# EAGLE schematic Sine 5KW co sac (EAGLE 9.6.2)
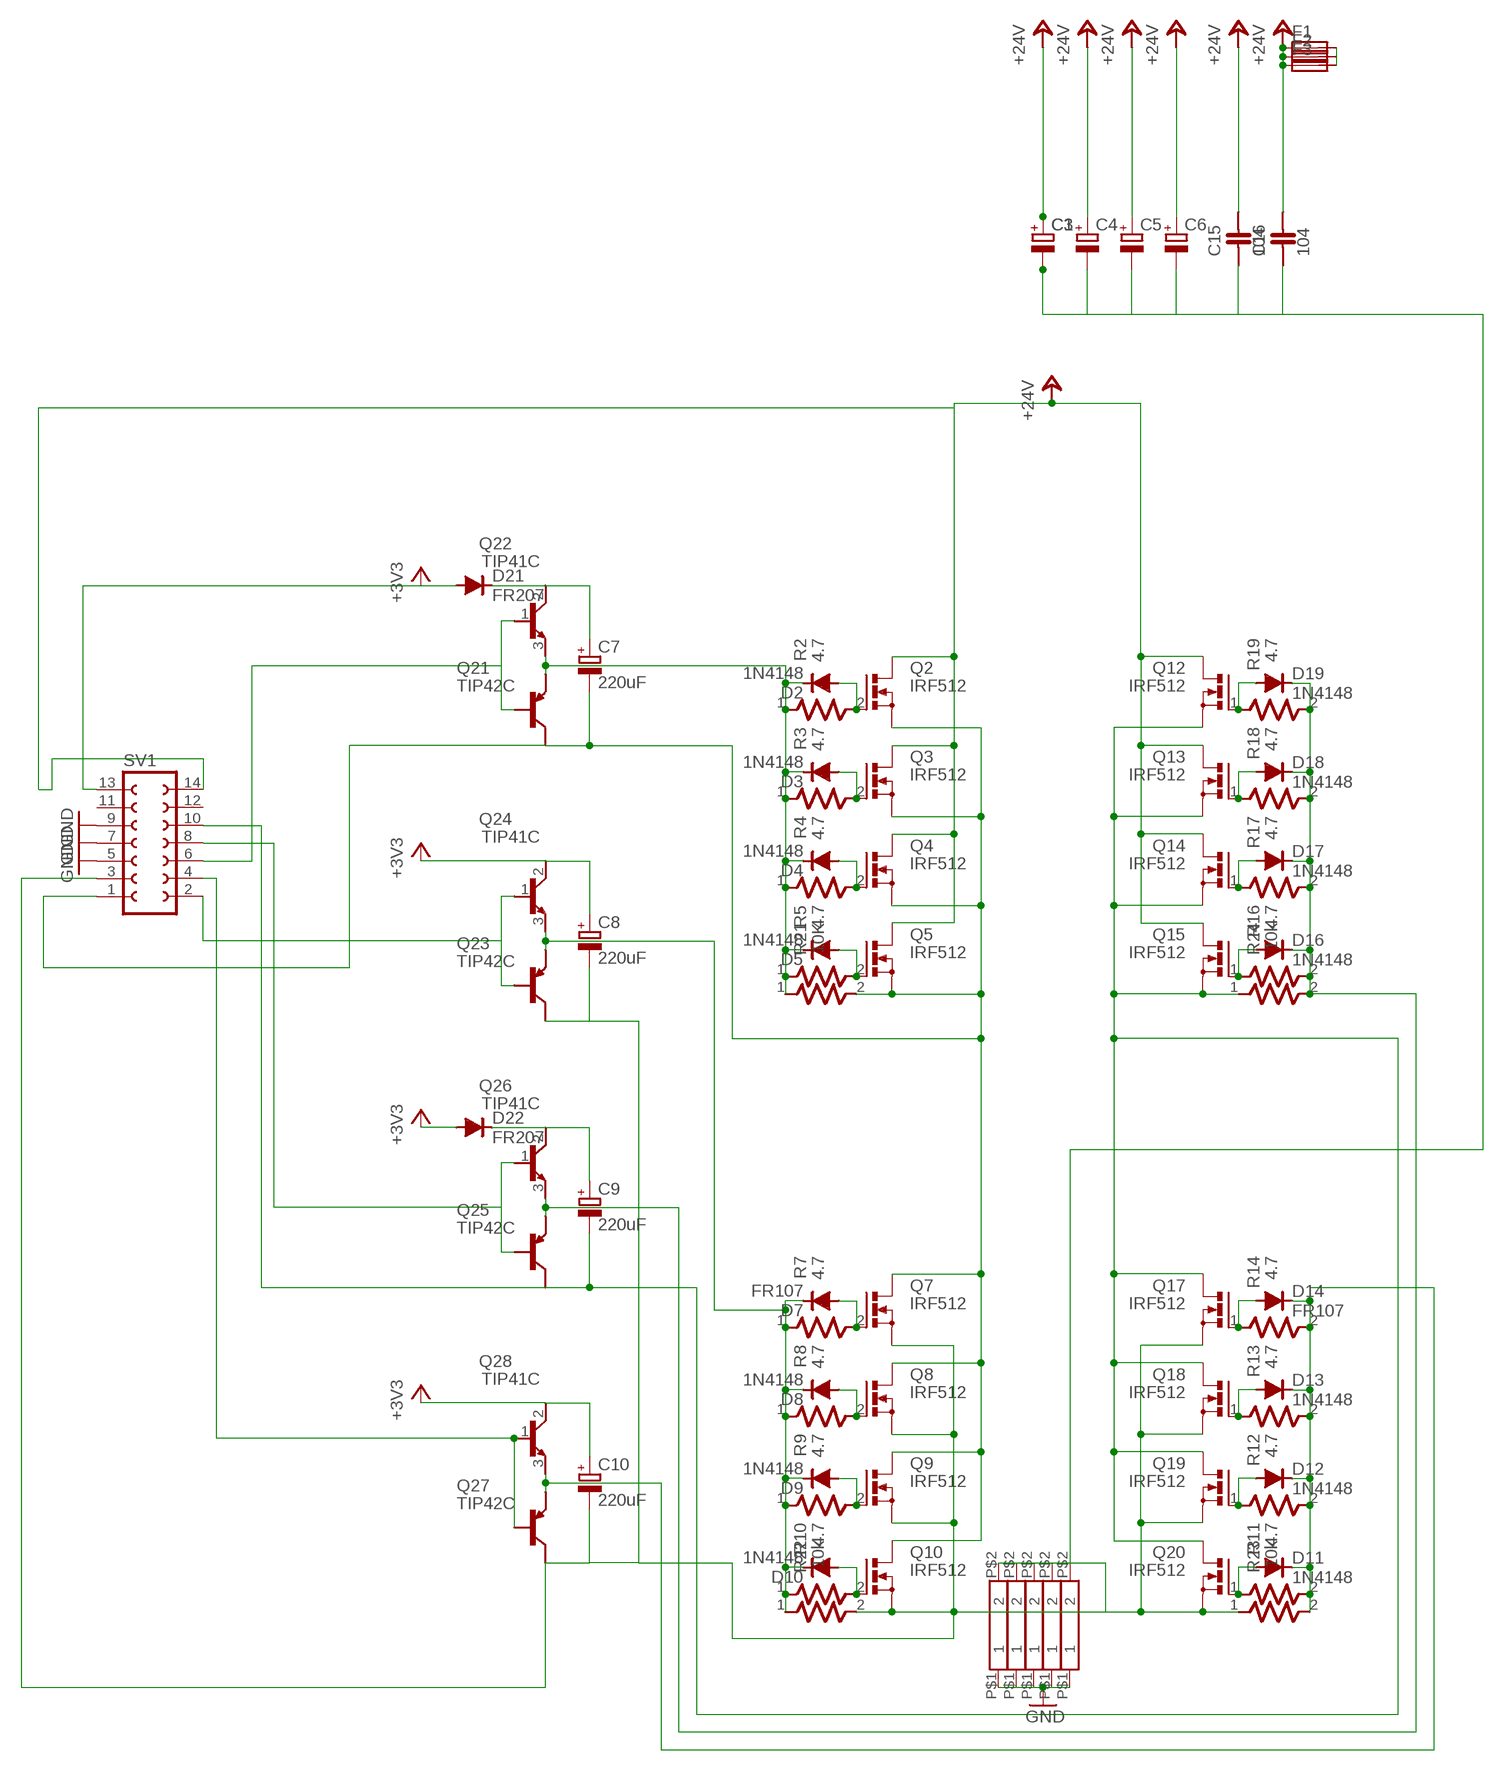
[diagram p0: schematic, sheet 1]

## Parts
C1  CPOL-EUE7.5-18  [E7,5-18]
C3  CPOL-EUE7.5-18  [E7,5-18]
C4  CPOL-EUE7.5-18  [E7,5-18]
C5  CPOL-EUE7.5-18  [E7,5-18]
C6  CPOL-EUE7.5-18  [E7,5-18]
C7  220uF  CPOL-EUE5-8.5  [E5-8,5]
C8  220uF  CPOL-EUE5-8.5  [E5-8,5]
C9  220uF  CPOL-EUE5-8.5  [E5-8,5]
C10  220uF  CPOL-EUE5-8.5  [E5-8,5]
C15  104  CAP-NP5  [CAP-NP5]
C16  104  CAP-NP5  [CAP-NP5]
D2  1N4148  [D-7,5]
D3  1N4148  [D-7,5]
D4  1N4148  [D-7,5]
D5  1N4148  [D-7,5]
D7  FR107  1N4148  [D-7,5]
D8  1N4148  [D-7,5]
D9  1N4148  [D-7,5]
D10  1N4148  [D-7,5]
D11  1N4148  [D-7,5]
D12  1N4148  [D-7,5]
D13  1N4148  [D-7,5]
D14  FR107  1N4148  [D-7,5]
D16  1N4148  [D-7,5]
D17  1N4148  [D-7,5]
D18  1N4148  [D-7,5]
D19  1N4148  [D-7,5]
D21  FR207  1N4148  [D-7,5]
D22  FR207  1N4148  [D-7,5]
F1  LITTLEFUSE  [LITTLEFUSE]
F2  LITTLEFUSE  [LITTLEFUSE]
F3  LITTLEFUSE  [LITTLEFUSE]
Q2  IRF512  [TO220BV]
Q3  IRF512  [TO220BV]
Q4  IRF512  [TO220BV]
Q5  IRF512  [TO220BV]
Q7  IRF512  [TO220BV]
Q8  IRF512  [TO220BV]
Q9  IRF512  [TO220BV]
Q10  IRF512  [TO220BV]
Q12  IRF512  [TO220BV]
Q13  IRF512  [TO220BV]
Q14  IRF512  [TO220BV]
Q15  IRF512  [TO220BV]
Q17  IRF512  [TO220BV]
Q18  IRF512  [TO220BV]
Q19  IRF512  [TO220BV]
Q20  IRF512  [TO220BV]
Q21  TIP42C  TIP-127  [TIP-127]
Q22  TIP41C  TIP122  [TIP-127]
Q23  TIP42C  TIP-127  [TIP-127]
Q24  TIP41C  TIP122  [TIP-127]
Q25  TIP42C  TIP-127  [TIP-127]
Q26  TIP41C  TIP122  [TIP-127]
Q27  TIP42C  TIP-127  [TIP-127]
Q28  TIP41C  TIP122  [TIP-127]
R2  4.7  R-7,5  [R-7,5]
R3  4.7  R-7,5  [R-7,5]
R4  4.7  R-7,5  [R-7,5]
R5  4.7  R-7,5  [R-7,5]
R7  4.7  R-7,5  [R-7,5]
R8  4.7  R-7,5  [R-7,5]
R9  4.7  R-7,5  [R-7,5]
R10  4.7  R-7,5  [R-7,5]
R11  4.7  R-7,5  [R-7,5]
R12  4.7  R-7,5  [R-7,5]
R13  4.7  R-7,5  [R-7,5]
R14  4.7  R-7,5  [R-7,5]
R16  4.7  R-7,5  [R-7,5]
R17  4.7  R-7,5  [R-7,5]
R18  4.7  R-7,5  [R-7,5]
R19  4.7  R-7,5  [R-7,5]
R21  10K  R-7,5  [R-7,5]
R22  10k  R-7,5  [R-7,5]
R23  10k  R-7,5  [R-7,5]
R24  10k  R-7,5  [R-7,5]
SV1  FE07-2  [FE07-2]
U$2  SHUNT  [SHUNT]
U$3  SHUNT  [SHUNT]
U$8  SHUNT  [SHUNT]
U$9  SHUNT  [SHUNT]
U$10  SHUNT  [SHUNT]

## Nets
+3V3: C8.+ C10.+ D21.A D22.A Q24.2(C) Q28.2(C) SV1.13
GND: SV1.5 SV1.7 SV1.9 U$2.P$1 U$3.P$1 U$8.P$1 U$9.P$1 U$10.P$1
N$1: Q23.1(B) Q24.1(B) SV1.2
N$2: C9.+ D22.C Q26.2(C)
N$3: Q21.1(B) Q22.1(B) SV1.6
N$4: D7.C D8.C D9.C D10.C Q23.3(E) Q24.3(E) R7.1 R8.1 R9.1 R10.1 R22.1
N$5: D13.A Q18.G R13.1
N$6: Q27.1(B) Q28.1(B) SV1.4
N$7: D2.A Q2.G R2.2
N$8: D3.A Q3.G R3.2
N$9: D4.A Q4.G R4.2
N$10: D5.A Q5.G R5.2
N$11: F1.2 F2.2 F3.2
N$12: D7.A Q7.G R7.2
N$13: D8.A Q8.G R8.2
N$14: D9.A Q9.G R9.2
N$15: D10.A Q10.G R10.2
N$16: D11.A Q20.G R11.1
N$17: D12.A Q19.G R12.1
N$18: C9.- Q12.S Q13.S Q14.S Q15.S Q17.D Q18.D Q19.D Q20.D Q25.2(C) R24.1 SV1.10
N$19: D16.A Q15.G R16.1
N$20: D17.A Q14.G R17.1
N$21: D18.A Q13.G R18.1
N$22: D19.A Q12.G R19.1
N$23: Q25.1(B) Q26.1(B) SV1.8
N$24: D14.A Q17.G R14.1
N$25: C1.- C3.- C4.- C5.- C6.- C8.- C10.- C15.1 C16.1 Q7.S Q8.S Q9.S Q10.S Q17.S Q18.S Q19.S Q20.S Q23.2(C) Q27.2(C) R22.2 R23.1 SV1.3 U$2.P$2 U$3.P$2 U$8.P$2 U$9.P$2 U$10.P$2
N$28: D11.C D12.C D13.C D14.C Q27.3(E) Q28.3(E) R11.2 R12.2 R13.2 R14.2 R23.2
N$29: D16.C D17.C D18.C D19.C Q25.3(E) Q26.3(E) R16.2 R17.2 R18.2 R19.2 R24.2
N$35: C7.- Q2.S Q3.S Q4.S Q5.S Q7.D Q8.D Q9.D Q10.D Q21.2(C) R21.2 SV1.1
N$36: C7.+ D21.C Q22.2(C)
N$68: D2.C D3.C D4.C D5.C Q21.3(E) Q22.3(E) R2.1 R3.1 R4.1 R5.1 R21.1
VCC: C1.+ C3.+ C4.+ C5.+ C6.+ C15.2 C16.2 F1.1 F2.1 F3.1 Q2.D Q3.D Q4.D Q5.D Q12.D Q13.D Q14.D Q15.D SV1.14 ; supply symbol labelled +24V
Unconnected: SV1.11 SV1.12

## Library data of the parts
C1 C3-C10 = LBR inverter true sine:CPOL-EU: POLARIZED CAPACITOR, European symbol
C15 C16 = lbr:CAP-NP5
D2-D5 D7-D14 D16-D19 D21 D22 = 4148:1N4148
F1-F3 = LBR inverter true sine:LITTLEFUSE: LITTLEFUSE Picofuse/slow Littlefuse; OC_FARNELL: unknown; OC_NEWARK: unknown
Q2-Q5 Q7-Q10 Q12 Q13 Q15 Q17-Q20 = LBR inverter true sine:IRF512: N-CHANNEL MOS FET
Q14 = LBR inverter true sine:IRF512: N-CHANNEL MOS FET; SPICEPREFIX: M
Q21 Q23 Q25 Q27 = LBR inverter true sine:TIP-127
Q22 Q24 Q26 Q28 = LBR inverter true sine:TIP122
R2-R5 R7-R14 R16-R19 R21-R24 = chuong:R-7,5
SV1 = con-lsta:FE07-2: FEMALE HEADER; OC_FARNELL: unknown; OC_NEWARK: unknown; SPICEPREFIX: X
U$2 U$3 U$8-U$10 = LBR inverter true sine:SHUNT